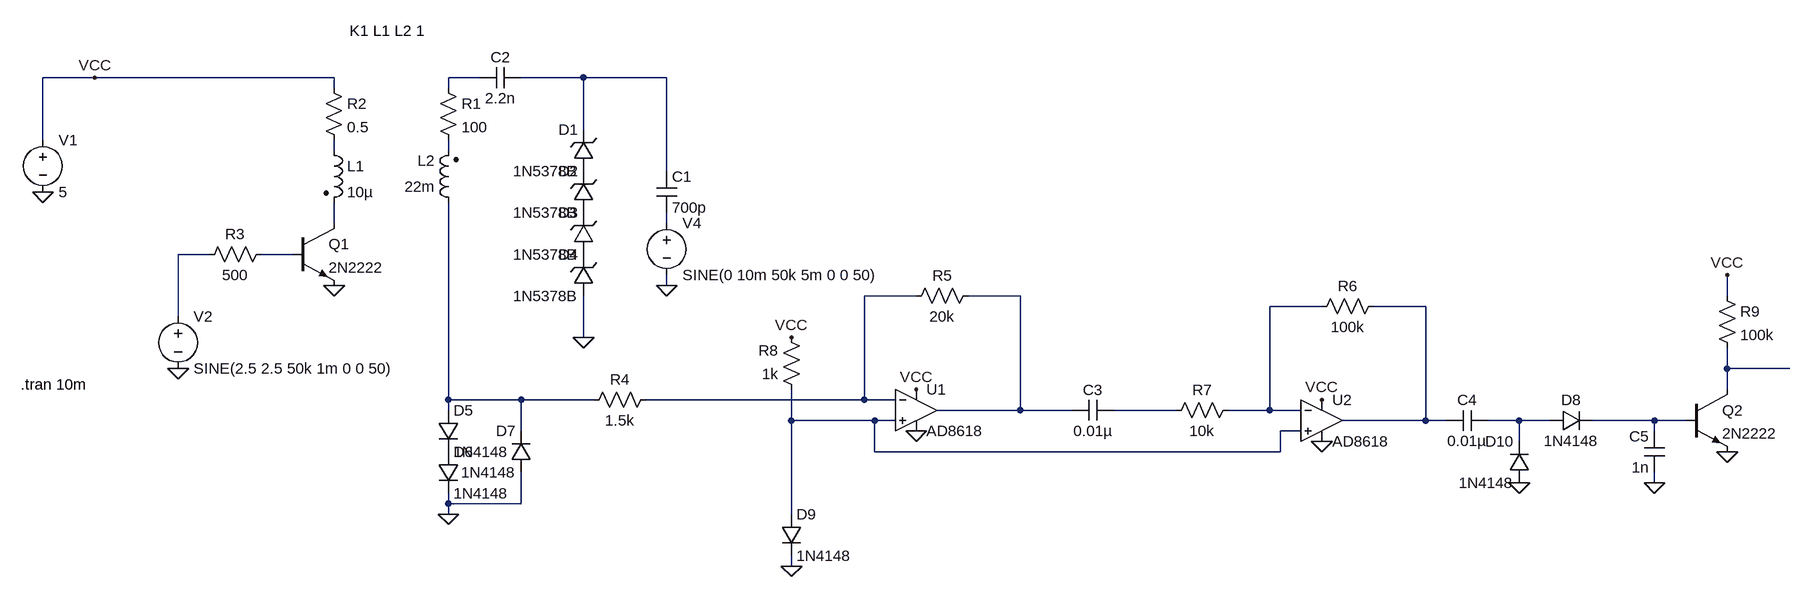
[diagram p0: schematic Simple_Ultrasonic.asc]
Simple_Ultrasonic.asc, the LTspice schematic file:
Version 4
SHEET 1 2148 772
WIRE -576 0 -656 0
WIRE -208 0 -576 0
WIRE 16 0 -32 0
WIRE 176 0 80 0
WIRE 304 0 176 0
WIRE -208 16 -208 0
WIRE -32 16 -32 0
WIRE 176 80 176 0
WIRE -656 96 -656 0
WIRE -208 112 -208 96
WIRE -32 112 -32 96
WIRE 304 144 304 0
WIRE -208 224 -208 192
WIRE 304 224 304 208
WIRE -400 272 -448 272
WIRE -272 272 -320 272
WIRE 304 320 304 304
WIRE 688 336 608 336
WIRE 848 336 768 336
WIRE 1936 336 1936 304
WIRE 1312 352 1232 352
WIRE 1472 352 1392 352
WIRE -448 368 -448 272
WIRE 176 400 176 336
WIRE 1936 448 1936 416
WIRE 2032 448 1936 448
WIRE 1936 480 1936 448
WIRE -32 496 -32 192
WIRE 80 496 -32 496
WIRE 192 496 80 496
WIRE 608 496 608 336
WIRE 608 496 272 496
WIRE 656 496 608 496
WIRE -32 512 -32 496
WIRE 848 512 848 336
WIRE 848 512 720 512
WIRE 928 512 848 512
WIRE 1088 512 992 512
WIRE 1232 512 1232 352
WIRE 1232 512 1168 512
WIRE 1280 512 1232 512
WIRE 496 528 496 480
WIRE 624 528 496 528
WIRE 656 528 624 528
WIRE 1472 528 1472 352
WIRE 1472 528 1344 528
WIRE 1504 528 1472 528
WIRE 1616 528 1568 528
WIRE 1664 528 1616 528
WIRE 1824 528 1728 528
WIRE 1872 528 1824 528
WIRE 80 544 80 496
WIRE 1280 544 1248 544
WIRE 1824 544 1824 528
WIRE 1616 560 1616 528
WIRE 624 576 624 528
WIRE 1248 576 1248 544
WIRE 1248 576 624 576
WIRE 1824 624 1824 608
WIRE -32 656 -32 640
WIRE 80 656 80 608
WIRE 80 656 -32 656
WIRE -32 672 -32 656
WIRE 496 672 496 528
WIRE 496 752 496 736
FLAG 176 400 0
FLAG 304 320 0
FLAG -656 176 0
FLAG -208 320 0
FLAG -448 448 0
FLAG -32 672 0
FLAG -576 0 VCC
FLAG 688 480 VCC
FLAG 688 544 0
FLAG 496 752 0
FLAG 1312 496 VCC
FLAG 1312 560 0
FLAG 496 400 VCC
FLAG 1616 624 0
FLAG 1936 576 0
FLAG 1824 624 0
FLAG 1936 304 VCC
SYMBOL cap 288 144 R0
SYMATTR InstName C1
SYMATTR Value 700p
SYMBOL zener 192 144 R180
WINDOW 0 24 64 Left 2
WINDOW 3 24 0 Left 2
SYMATTR InstName D1
SYMATTR Value 1N5378B
SYMATTR Description Diode
SYMATTR Type diode
SYMBOL zener 192 208 R180
WINDOW 0 24 64 Left 2
WINDOW 3 24 0 Left 2
SYMATTR InstName D2
SYMATTR Value 1N5378B
SYMATTR Description Diode
SYMATTR Type diode
SYMBOL ind2 -224 96 R0
SYMATTR InstName L1
SYMATTR Value 10µ
SYMATTR Type ind
SYMBOL ind2 -16 208 R180
WINDOW 0 36 80 Left 2
WINDOW 3 36 40 Left 2
SYMATTR InstName L2
SYMATTR Value 22m
SYMATTR Type ind
SYMBOL res -48 0 R0
SYMATTR InstName R1
SYMATTR Value 100
SYMBOL res -224 0 R0
SYMATTR InstName R2
SYMATTR Value 0.5
SYMBOL voltage -656 80 R0
SYMATTR InstName V1
SYMATTR Value 5
SYMBOL npn -272 224 R0
SYMATTR InstName Q1
SYMATTR Value 2N2222
SYMBOL voltage -448 352 R0
WINDOW 123 0 0 Left 0
WINDOW 39 0 0 Left 0
SYMATTR InstName V2
SYMATTR Value SINE(2.5 2.5 50k 1m 0 0 50)
SYMBOL res -304 256 R90
WINDOW 0 0 56 VBottom 2
WINDOW 3 32 56 VTop 2
SYMATTR InstName R3
SYMATTR Value 500
SYMBOL cap 80 -16 R90
WINDOW 0 0 32 VBottom 2
WINDOW 3 32 32 VTop 2
SYMATTR InstName C2
SYMATTR Value 2.2n
SYMBOL zener 192 272 R180
WINDOW 0 24 64 Left 2
WINDOW 3 24 0 Left 2
SYMATTR InstName D3
SYMATTR Value 1N5378B
SYMATTR Description Diode
SYMATTR Type diode
SYMBOL zener 192 336 R180
WINDOW 0 24 64 Left 2
WINDOW 3 24 0 Left 2
SYMATTR InstName D4
SYMATTR Value 1N5378B
SYMATTR Description Diode
SYMATTR Type diode
SYMBOL diode -48 512 R0
SYMATTR InstName D5
SYMATTR Value 1N4148
SYMBOL diode -48 576 R0
SYMATTR InstName D6
SYMATTR Value 1N4148
SYMBOL diode 96 608 R180
WINDOW 0 24 64 Left 2
WINDOW 3 24 0 Left 2
SYMATTR InstName D7
SYMATTR Value 1N4148
SYMBOL Opamps\\AD8618 688 448 R0
SYMATTR InstName U1
SYMBOL res 288 480 R90
WINDOW 0 0 56 VBottom 2
WINDOW 3 32 56 VTop 2
SYMATTR InstName R4
SYMATTR Value 1.5k
SYMBOL res 784 320 R90
WINDOW 0 0 56 VBottom 2
WINDOW 3 32 56 VTop 2
SYMATTR InstName R5
SYMATTR Value 20k
SYMBOL voltage 304 208 R0
WINDOW 123 0 0 Left 0
WINDOW 39 0 0 Left 0
SYMATTR InstName V4
SYMATTR Value SINE(0 10m 50k 5m 0 0 50)
SYMBOL Opamps\\AD8618 1312 464 R0
SYMATTR InstName U2
SYMBOL res 1408 336 R90
WINDOW 0 0 56 VBottom 2
WINDOW 3 32 56 VTop 2
SYMATTR InstName R6
SYMATTR Value 100k
SYMBOL res 1184 496 R90
WINDOW 0 0 56 VBottom 2
WINDOW 3 32 56 VTop 2
SYMATTR InstName R7
SYMATTR Value 10k
SYMBOL diode 480 672 R0
SYMATTR InstName D9
SYMATTR Value 1N4148
SYMBOL res 512 496 R180
WINDOW 0 36 76 Left 2
WINDOW 3 36 40 Left 2
SYMATTR InstName R8
SYMATTR Value 1k
SYMBOL cap 992 496 R90
WINDOW 0 0 32 VBottom 2
WINDOW 3 32 32 VTop 2
SYMATTR InstName C3
SYMATTR Value 0.01µ
SYMBOL cap 1568 512 R90
WINDOW 0 0 32 VBottom 2
WINDOW 3 32 32 VTop 2
SYMATTR InstName C4
SYMATTR Value 0.01µ
SYMBOL diode 1664 544 R270
WINDOW 0 32 32 VTop 2
WINDOW 3 0 32 VBottom 2
SYMATTR InstName D8
SYMATTR Value 1N4148
SYMBOL diode 1632 624 R180
WINDOW 0 24 64 Left 2
WINDOW 3 24 0 Left 2
SYMATTR InstName D10
SYMATTR Value 1N4148
SYMBOL cap 1840 608 R180
WINDOW 0 24 56 Left 2
WINDOW 3 24 8 Left 2
SYMATTR InstName C5
SYMATTR Value 1n
SYMBOL npn 1872 480 R0
SYMATTR InstName Q2
SYMATTR Value 2N2222
SYMBOL res 1920 320 R0
SYMATTR InstName R9
SYMATTR Value 100k
TEXT -690 472 Left 2 !.tran 10m
TEXT -184 -72 Left 2 !K1 L1 L2 1

The netlist it stands for:
* Simple_Ultrasonic.asc
C1 N002 N006 700p
D1 P001 N002 1N5378B
D2 P002 P001 1N5378B
L1 N003 N005 10µ
L2 N014 N004 22m
R1 N001 N004 100
R2 VCC N003 0.5
V1 VCC 0 5
Q1 N005 N008 0 0 2N2222
V2 N007 0 SINE(2.5 2.5 50k 1m 0 0 50)
R3 N008 N007 500
C2 N002 N001 2.2n
D3 P003 P002 1N5378B
D4 0 P003 1N5378B
D5 N014 P004 1N4148
D6 P004 0 1N4148
D7 0 N014 1N4148
XU1 N016 N009 VCC 0 N010 AD8618  ; pins In+ In- V+ V- OUT
R4 N009 N014 1.5k
R5 N010 N009 20k
V4 N006 0 SINE(0 10m 50k 5m 0 0 50)
XU2 N016 N011 VCC 0 N012 AD8618  ; pins In+ In- V+ V- OUT
R6 N012 N011 100k
R7 N011 N015 10k
D9 N016 0 1N4148
R8 N016 VCC 1k
C3 N015 N010 0.01µ
C4 N017 N012 0.01µ
D8 N017 N018 1N4148
D10 0 N017 1N4148
C5 0 N018 1n
Q2 N013 N018 0 0 2N2222
R9 VCC N013 100k
.model D D
.lib standard.dio
.model NPN NPN
.model PNP PNP
.lib standard.bjt
.tran 10m
K1 L1 L2 1
.backanno
.end